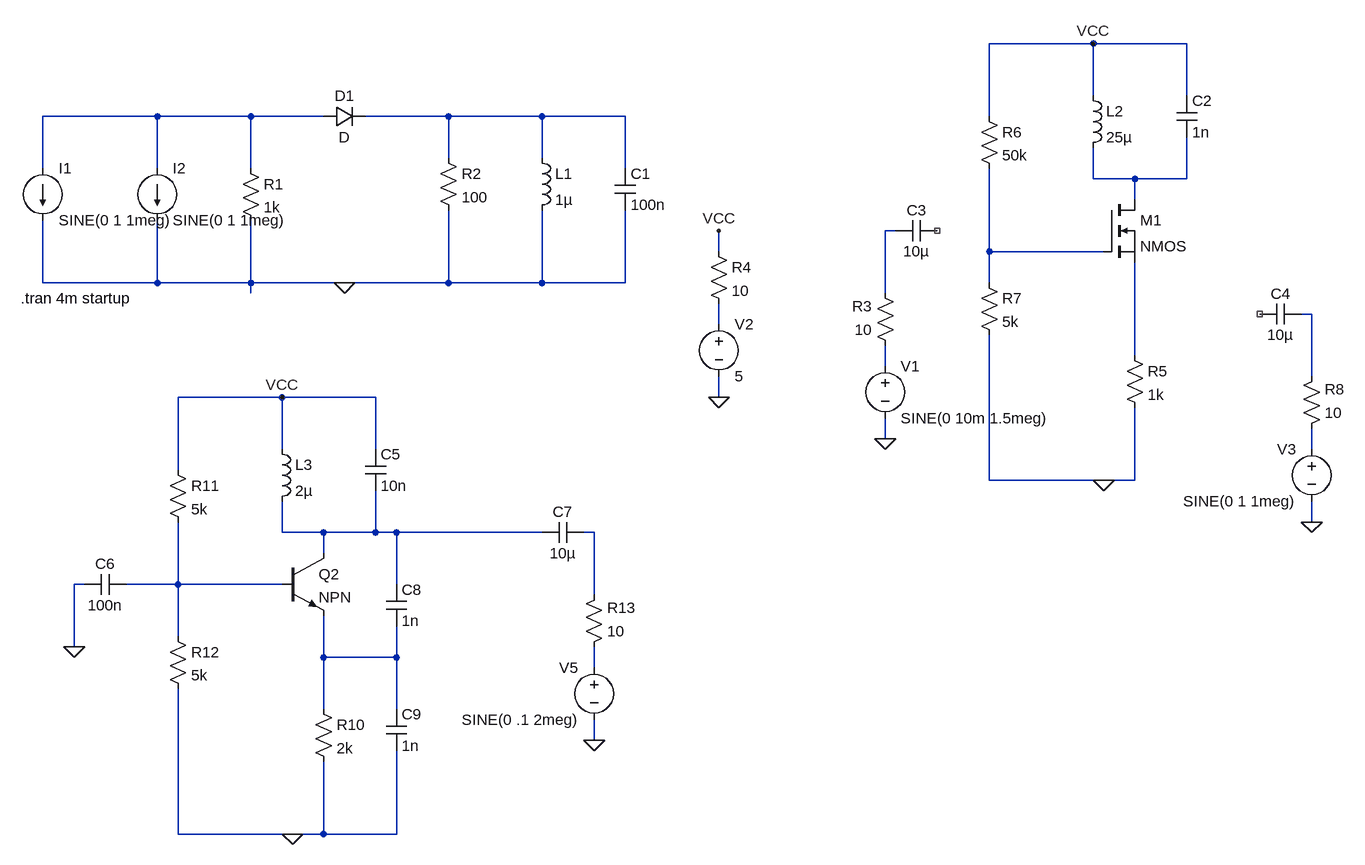
[diagram p0: schematic mixer-pruebas.asc]
mixer-pruebas.asc, the LTspice schematic file:
Version 4
SHEET 1 2072 1236
WIRE 1680 -64 1520 -64
WIRE 1824 -64 1680 -64
WIRE 1680 16 1680 -64
WIRE 1824 16 1824 -64
WIRE 240 48 64 48
WIRE 384 48 240 48
WIRE 496 48 384 48
WIRE 688 48 560 48
WIRE 832 48 688 48
WIRE 960 48 832 48
WIRE 1520 48 1520 -64
WIRE 688 112 688 48
WIRE 832 112 832 48
WIRE 64 128 64 48
WIRE 240 128 240 48
WIRE 384 128 384 48
WIRE 960 128 960 48
WIRE 1680 144 1680 96
WIRE 1744 144 1680 144
WIRE 1824 144 1824 80
WIRE 1824 144 1744 144
WIRE 1744 176 1744 144
WIRE 1376 224 1360 224
WIRE 1104 256 1104 224
WIRE 1520 256 1520 128
WIRE 1696 256 1520 256
WIRE 64 304 64 208
WIRE 240 304 240 208
WIRE 240 304 64 304
WIRE 384 304 384 208
WIRE 384 304 240 304
WIRE 528 304 384 304
WIRE 688 304 688 192
WIRE 688 304 528 304
WIRE 832 304 832 192
WIRE 832 304 688 304
WIRE 960 304 960 192
WIRE 960 304 832 304
WIRE 1520 304 1520 256
WIRE 384 320 384 304
WIRE 1360 320 1360 224
WIRE 2016 352 2000 352
WIRE 1104 368 1104 336
WIRE 1744 416 1744 272
WIRE 1360 432 1360 400
WIRE 2016 448 2016 352
WIRE 432 480 272 480
WIRE 576 480 432 480
WIRE 1104 480 1104 448
WIRE 1360 544 1360 512
WIRE 432 560 432 480
WIRE 576 560 576 480
WIRE 2016 560 2016 528
WIRE 272 592 272 480
WIRE 1520 608 1520 384
WIRE 1696 608 1520 608
WIRE 1744 608 1744 496
WIRE 1744 608 1696 608
WIRE 2016 672 2016 640
WIRE 432 688 432 640
WIRE 496 688 432 688
WIRE 576 688 576 624
WIRE 576 688 496 688
WIRE 608 688 576 688
WIRE 832 688 608 688
WIRE 912 688 896 688
WIRE 496 720 496 688
WIRE 128 768 112 768
WIRE 272 768 272 672
WIRE 272 768 192 768
WIRE 432 768 272 768
WIRE 608 768 608 688
WIRE 912 784 912 688
WIRE 272 848 272 768
WIRE 112 864 112 768
WIRE 496 880 496 816
WIRE 608 880 608 832
WIRE 608 880 496 880
WIRE 912 896 912 864
WIRE 496 960 496 880
WIRE 608 960 608 880
WIRE 912 1008 912 976
WIRE 272 1152 272 928
WIRE 448 1152 272 1152
WIRE 496 1152 496 1040
WIRE 496 1152 448 1152
WIRE 608 1152 608 1024
WIRE 608 1152 496 1152
FLAG 528 304 0
FLAG 1104 480 0
FLAG 1360 544 0
FLAG 1696 608 0
FLAG 1104 224 VCC
FLAG 1680 -64 VCC
FLAG 2016 672 0
FLAG 448 1152 0
FLAG 432 480 VCC
FLAG 912 1008 0
FLAG 112 864 0
SYMBOL current 64 128 R0
WINDOW 123 0 0 Left 0
WINDOW 39 0 0 Left 0
SYMATTR InstName I1
SYMATTR Value SINE(0 1 1meg)
SYMBOL current 240 128 R0
WINDOW 123 0 0 Left 0
WINDOW 39 0 0 Left 0
SYMATTR InstName I2
SYMATTR Value SINE(0 1 1meg)
SYMBOL diode 496 64 R270
WINDOW 0 32 32 VTop 2
WINDOW 3 0 32 VBottom 2
SYMATTR InstName D1
SYMBOL res 368 112 R0
SYMATTR InstName R1
SYMATTR Value 1k
SYMBOL res 672 96 R0
SYMATTR InstName R2
SYMATTR Value 100
SYMBOL ind 816 96 R0
SYMATTR InstName L1
SYMATTR Value 1µ
SYMBOL cap 944 128 R0
SYMATTR InstName C1
SYMATTR Value 100n
SYMBOL voltage 1360 416 R0
WINDOW 123 0 0 Left 0
WINDOW 39 0 0 Left 0
SYMATTR InstName V1
SYMATTR Value SINE(0 10m 1.5meg)
SYMBOL res 1376 416 R180
WINDOW 0 36 76 Left 2
WINDOW 3 36 40 Left 2
SYMATTR InstName R3
SYMATTR Value 10
SYMBOL voltage 1104 352 R0
WINDOW 123 0 0 Left 0
WINDOW 39 0 0 Left 0
SYMATTR InstName V2
SYMATTR Value 5
SYMBOL res 1088 240 R0
SYMATTR InstName R4
SYMATTR Value 10
SYMBOL res 1728 400 R0
SYMATTR InstName R5
SYMATTR Value 1k
SYMBOL cap 1808 16 R0
SYMATTR InstName C2
SYMATTR Value 1n
SYMBOL ind 1664 0 R0
SYMATTR InstName L2
SYMATTR Value 25µ
SYMBOL res 1504 32 R0
SYMATTR InstName R6
SYMATTR Value 50k
SYMBOL res 1504 288 R0
SYMATTR InstName R7
SYMATTR Value 5k
SYMBOL cap 1440 208 R90
WINDOW 0 0 32 VBottom 2
WINDOW 3 32 32 VTop 2
SYMATTR InstName C3
SYMATTR Value 10µ
SYMBOL voltage 2016 544 M0
WINDOW 123 0 0 Left 0
WINDOW 39 0 0 Left 0
SYMATTR InstName V3
SYMATTR Value SINE(0 1 1meg)
SYMBOL res 2000 544 M180
WINDOW 0 36 76 Left 2
WINDOW 3 36 40 Left 2
SYMATTR InstName R8
SYMATTR Value 10
SYMBOL cap 1936 336 M90
WINDOW 0 0 32 VBottom 2
WINDOW 3 32 32 VTop 2
SYMATTR InstName C4
SYMATTR Value 10µ
SYMBOL npn 432 720 R0
SYMATTR InstName Q2
SYMBOL res 480 944 R0
SYMATTR InstName R10
SYMATTR Value 2k
SYMBOL cap 560 560 R0
SYMATTR InstName C5
SYMATTR Value 10n
SYMBOL ind 416 544 R0
SYMATTR InstName L3
SYMATTR Value 2µ
SYMBOL res 256 576 R0
SYMATTR InstName R11
SYMATTR Value 5k
SYMBOL res 256 832 R0
SYMATTR InstName R12
SYMATTR Value 5k
SYMBOL cap 192 752 R90
WINDOW 0 0 32 VBottom 2
WINDOW 3 32 32 VTop 2
SYMATTR InstName C6
SYMATTR Value 100n
SYMBOL voltage 912 880 M0
WINDOW 123 0 0 Left 0
WINDOW 39 0 0 Left 0
SYMATTR InstName V5
SYMATTR Value SINE(0 .1 2meg)
SYMBOL res 896 880 M180
WINDOW 0 36 76 Left 2
WINDOW 3 36 40 Left 2
SYMATTR InstName R13
SYMATTR Value 10
SYMBOL cap 832 672 M90
WINDOW 0 0 32 VBottom 2
WINDOW 3 32 32 VTop 2
SYMATTR InstName C7
SYMATTR Value 10µ
SYMBOL cap 592 768 R0
SYMATTR InstName C8
SYMATTR Value 1n
SYMBOL cap 592 960 R0
SYMATTR InstName C9
SYMATTR Value 1n
SYMBOL nmos 1696 176 R0
SYMATTR InstName M1
TEXT 30 328 Left 2 !.tran 4m startup

The netlist it stands for:
* mixer-pruebas.asc
I1 N001 0 SINE(0 1 1meg)
I2 N001 0 SINE(0 1 1meg)
D1 N001 N002 D
R1 N001 0 1k
R2 N002 0 100
L1 N002 0 1µ
C1 N002 0 100n
V1 N009 0 SINE(0 10m 1.5meg)
R3 N009 N004 10
V2 N007 0 5
R4 VCC N007 10
R5 N008 0 1k
C2 VCC N003 1n
L2 VCC N003 25µ
R6 VCC N005 50k
R7 N005 0 5k
C3 NC_01 N004 10µ
V3 N010 0 SINE(0 1 1meg)
R8 N010 N006 10
C4 NC_02 N006 10µ
Q2 N011 N013 N014 0 NPN
R10 N014 0 2k
C5 VCC N011 10n
L3 VCC N011 2µ
R11 VCC N013 5k
R12 N013 0 5k
C6 N013 0 100n
V5 N015 0 SINE(0 .1 2meg)
R13 N015 N012 10
C7 N011 N012 10µ
C8 N011 N014 1n
C9 N014 0 1n
M1 N003 N005 N008 N008 NMOS
.model D D
.lib standard.dio
.model NPN NPN
.model PNP PNP
.lib standard.bjt
.model NMOS NMOS
.model PMOS PMOS
.lib standard.mos
.tran 4m startup
.backanno
.end